# Altium schematic sheet FDC1004DGST.SchDoc
size A
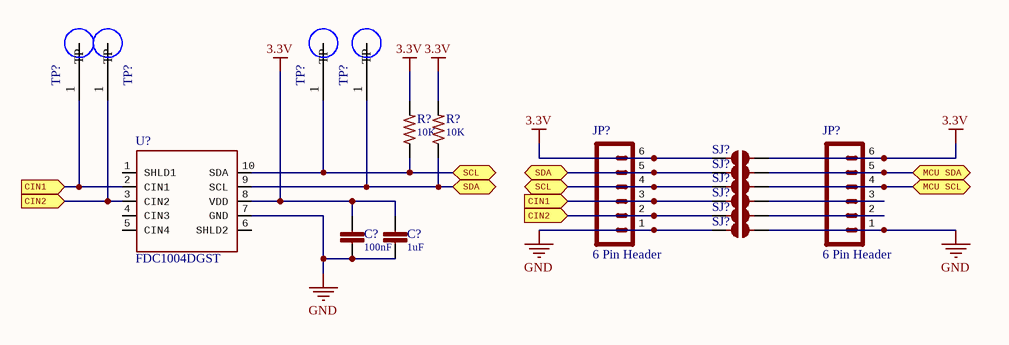
[diagram p0: FDC1004DGST.SchDoc]

## Parts
(Parts that share a designator on the sheet are numbered #1, #2 ... from top to bottom, then left to right.)
C?#1  value 100nF  (hidden comment: Cap100nF)
C?#2  value 1uF  (hidden comment: Cap1uF)
JP?#1  6 Pin Header
JP?#2  6 Pin Header
R?#1  value 10K  (hidden comment: Res10K)
R?#2  value 10K  (hidden comment: Res10K)
SJ?#1  Solder Jumper  (value not drawn)
SJ?#2  Solder Jumper  (value not drawn)
SJ?#3  Solder Jumper  (value not drawn)
SJ?#4  Solder Jumper  (value not drawn)
SJ?#5  Solder Jumper  (value not drawn)
SJ?#6  Solder Jumper  (value not drawn)
TP?#1  5019  [*TP380X203]  (value not drawn)
TP?#2  5019  [*TP380X203]  (value not drawn)
TP?#3  5019  [*TP380X203]  (value not drawn)
TP?#4  5019  [*TP380X203]  (value not drawn)
U?  FDC1004DGST  [FDC1004DGST]

## Ports
CIN1 (in), CIN2 (in), MCU SCL, MCU SDA, SCL, SDA

## Nets
3.3V: C?#1.1 C?#2.1 JP?#1.6 JP?#2.6 R?#1.2 R?#2.2 SJ?#1.1 SJ?#1.2 U?.8(VDD)
GND: C?#1.2 C?#2.2 JP?#1.1 JP?#2.1 SJ?#6.1 SJ?#6.2 U?.7(GND)
CIN1: JP?#1.3 SJ?#4.1 TP?#1.1(TP) U?.2(CIN1) ; port CIN1
CIN2: JP?#1.2 SJ?#5.1 TP?#2.1(TP) U?.3(CIN2) ; port CIN2
MCU SCL: JP?#2.4 SJ?#3.2 ; port MCU SCL
MCU SDA: JP?#2.5 SJ?#2.2 ; port MCU SDA
SCL: JP?#1.4 R?#1.1 SJ?#3.1 TP?#3.1(TP) U?.10(SDA) ; port SCL
SDA: JP?#1.5 R?#2.1 SJ?#2.1 TP?#4.1(TP) U?.9(SCL) ; port SDA
NetJP?#2_2: JP?#2.2 SJ?#5.2
NetJP?#2_3: JP?#2.3 SJ?#4.2

Not connected (* = marked no-connect by the designer): U? 1(SHLD1) 4(CIN3) 5(CIN4) 6(SHLD2)

## Library data of the parts
TP?#1-TP?#4 = 5019: Phosphor Bronze Contact Miniature Silver Plated Surface Mount Test Points; MF: Keystone Electronics; Package: 2010 Keystone; Price: None; Availability: Unavailable; MP: 5019; SnapEDA_Link: https://www.snapeda.com/parts/5019/Keystone%20Electronics/view-part/?ref=snap; Value: *